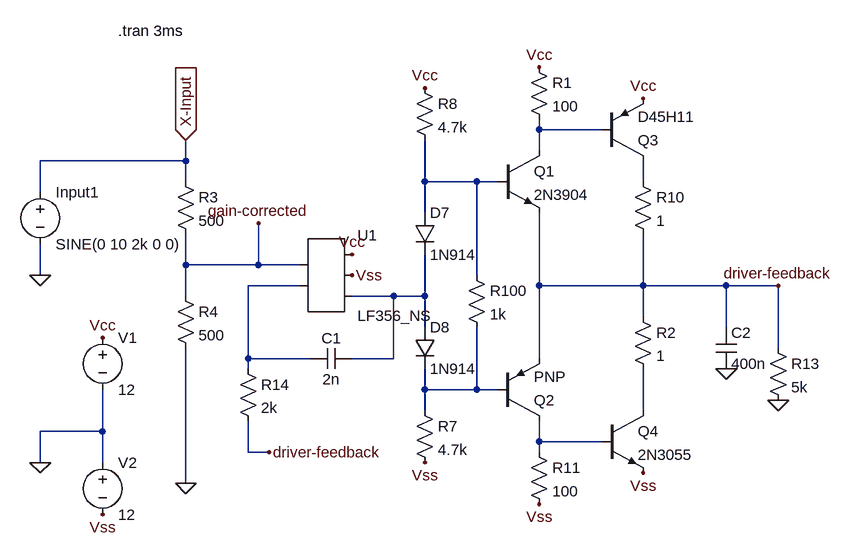
[diagram p0: schematic Atari Deflector X - Op Amp - Sans Autogain.asc]
Atari Deflector X - Op Amp - Sans Autogain.asc, the LTspice schematic file:
Version 4
SHEET 1 1248 680
WIRE 768 -368 768 -384
WIRE 864 -368 768 -368
WIRE 768 -336 768 -368
WIRE 224 -320 224 -352
WIRE 224 -320 0 -320
WIRE 224 -288 224 -320
WIRE 592 -288 592 -352
WIRE 672 -288 592 -288
WIRE 704 -288 672 -288
WIRE 928 -288 928 -320
WIRE 0 -272 0 -320
WIRE 592 -240 592 -288
WIRE 224 -160 224 -208
WIRE 336 -160 336 -224
WIRE 336 -160 224 -160
WIRE 400 -160 336 -160
WIRE 0 -144 0 -192
WIRE 672 -144 672 -288
WIRE 400 -128 320 -128
WIRE 768 -128 768 -240
WIRE 928 -128 928 -208
WIRE 928 -128 768 -128
WIRE 1056 -128 928 -128
WIRE 1136 -128 1056 -128
WIRE 224 -112 224 -160
WIRE 544 -112 480 -112
WIRE 592 -112 592 -176
WIRE 592 -112 544 -112
WIRE 928 -80 928 -128
WIRE 592 -64 592 -112
WIRE 1056 -64 1056 -128
WIRE 1136 -32 1136 -128
WIRE 320 -16 320 -128
WIRE 416 -16 320 -16
WIRE 544 -16 544 -112
WIRE 544 -16 480 -16
WIRE 768 -16 768 -128
WIRE 320 0 320 -16
WIRE 592 32 592 0
WIRE 672 32 672 -64
WIRE 672 32 592 32
WIRE 704 32 672 32
WIRE 592 64 592 32
WIRE 928 64 928 0
WIRE 96 96 96 32
WIRE 96 96 0 96
WIRE 768 112 768 80
WIRE 864 112 768 112
WIRE 320 128 320 80
WIRE 352 128 320 128
WIRE 768 128 768 112
WIRE 0 144 0 96
WIRE 96 144 96 96
WIRE 224 176 224 -32
FLAG 224 -352 X-Input
IOPIN 224 -352 In
FLAG 0 -144 0
FLAG 336 -224 gain-corrected
FLAG 0 144 0
FLAG 96 -48 Vcc
FLAG 96 224 Vss
FLAG 480 -176 Vcc
FLAG 480 -144 Vss
FLAG 592 -432 Vcc
FLAG 592 144 Vss
FLAG 768 -464 Vcc
FLAG 928 -416 Vcc
FLAG 768 208 Vss
FLAG 928 160 Vss
FLAG 1136 48 0
FLAG 1136 -128 driver-feedback
FLAG 352 128 driver-feedback
FLAG 1056 0 0
FLAG 224 176 0
SYMBOL res 208 -304 R0
SYMATTR InstName R3
SYMATTR Value 500
SYMBOL res 208 -128 R0
SYMATTR InstName R4
SYMATTR Value 500
SYMBOL voltage 0 -288 R0
SYMATTR InstName Input1
SYMATTR Value SINE(0 10 2k 0 0)
SYMBOL AutoGenerated/LF356_NS 432 -144 R0
SYMATTR InstName U1
SYMBOL voltage 96 -64 R0
SYMATTR InstName V1
SYMATTR Value 12
SYMBOL voltage 96 128 R0
SYMATTR InstName V2
SYMATTR Value 12
SYMBOL diode 576 -240 R0
SYMATTR InstName D7
SYMATTR Value 1N914
SYMBOL diode 576 -64 R0
SYMATTR InstName D8
SYMATTR Value 1N914
SYMBOL res 576 48 R0
SYMATTR InstName R7
SYMATTR Value 4.7k
SYMBOL res 576 -448 R0
SYMATTR InstName R8
SYMATTR Value 4.7k
SYMBOL npn 704 -336 R0
SYMATTR InstName Q1
SYMATTR Value 2N3904
SYMBOL res 752 -480 R0
SYMATTR InstName R1
SYMATTR Value 100
SYMBOL npn 864 64 R0
SYMATTR InstName Q4
SYMATTR Value 2N3055
SYMBOL res 912 -304 R0
SYMATTR InstName R10
SYMATTR Value 1
SYMBOL res 752 112 R0
SYMATTR InstName R11
SYMATTR Value 100
SYMBOL res 912 -96 R0
SYMATTR InstName R2
SYMATTR Value 1
SYMBOL pnp 704 80 M180
SYMATTR InstName Q2
SYMBOL pnp 864 -320 M180
SYMATTR InstName Q3
SYMATTR Value D45H11
SYMBOL res 1120 -48 R0
SYMATTR InstName R13
SYMATTR Value 5k
SYMBOL res 304 -16 R0
SYMATTR InstName R14
SYMATTR Value 2k
SYMBOL cap 480 -32 R90
WINDOW 0 0 32 VBottom 2
WINDOW 3 32 32 VTop 2
SYMATTR InstName C1
SYMATTR Value 2n
SYMBOL cap 1040 -64 R0
SYMATTR InstName C2
SYMATTR Value 400n
SYMBOL res 656 -160 R0
SYMATTR InstName R100
SYMATTR Value 1k
TEXT 120 -520 Left 2 !.tran 3ms

The netlist it stands for:
* Atari Deflector X - Op Amp - Sans Autogain.asc
R3 X-Input gain-corrected 500
R4 gain-corrected 0 500
V§Input1 X-Input 0 SINE(0 10 2k 0 0)
* U1: LF356_NS (symbol AutoGenerated/LF356_NS not available, pins judged from their places): pin1=gain-corrected pin2=N004 pin3=Vcc pin4=Vss pin5=N005
V1 Vcc 0 12
V2 0 Vss 12
D7 N002 N005 1N914
D8 N005 N006 1N914
R7 N006 Vss 4.7k
R8 Vcc N002 4.7k
Q1 N001 N002 driver-feedback 0 2N3904
R1 Vcc N001 100
Q4 N007 N008 Vss 0 2N3055
R10 N003 driver-feedback 1
R11 N008 Vss 100
R2 driver-feedback N007 1
Q2 N008 N006 driver-feedback 0 PNP
Q3 N003 N001 Vcc 0 D45H11
R13 driver-feedback 0 5k
R14 N004 driver-feedback 2k
C1 N005 N004 2n
C2 driver-feedback 0 400n
R100 N002 N006 1k
.model D D
.lib standard.dio
.model NPN NPN
.model PNP PNP
.lib standard.bjt
.tran 3ms
.backanno
.end